# Altium project PC104-M7.PrjPcb (part 2 of 2)

## Sheet Power.SchDoc
size A4; SheetNumber: 10; SheetTotal: 12
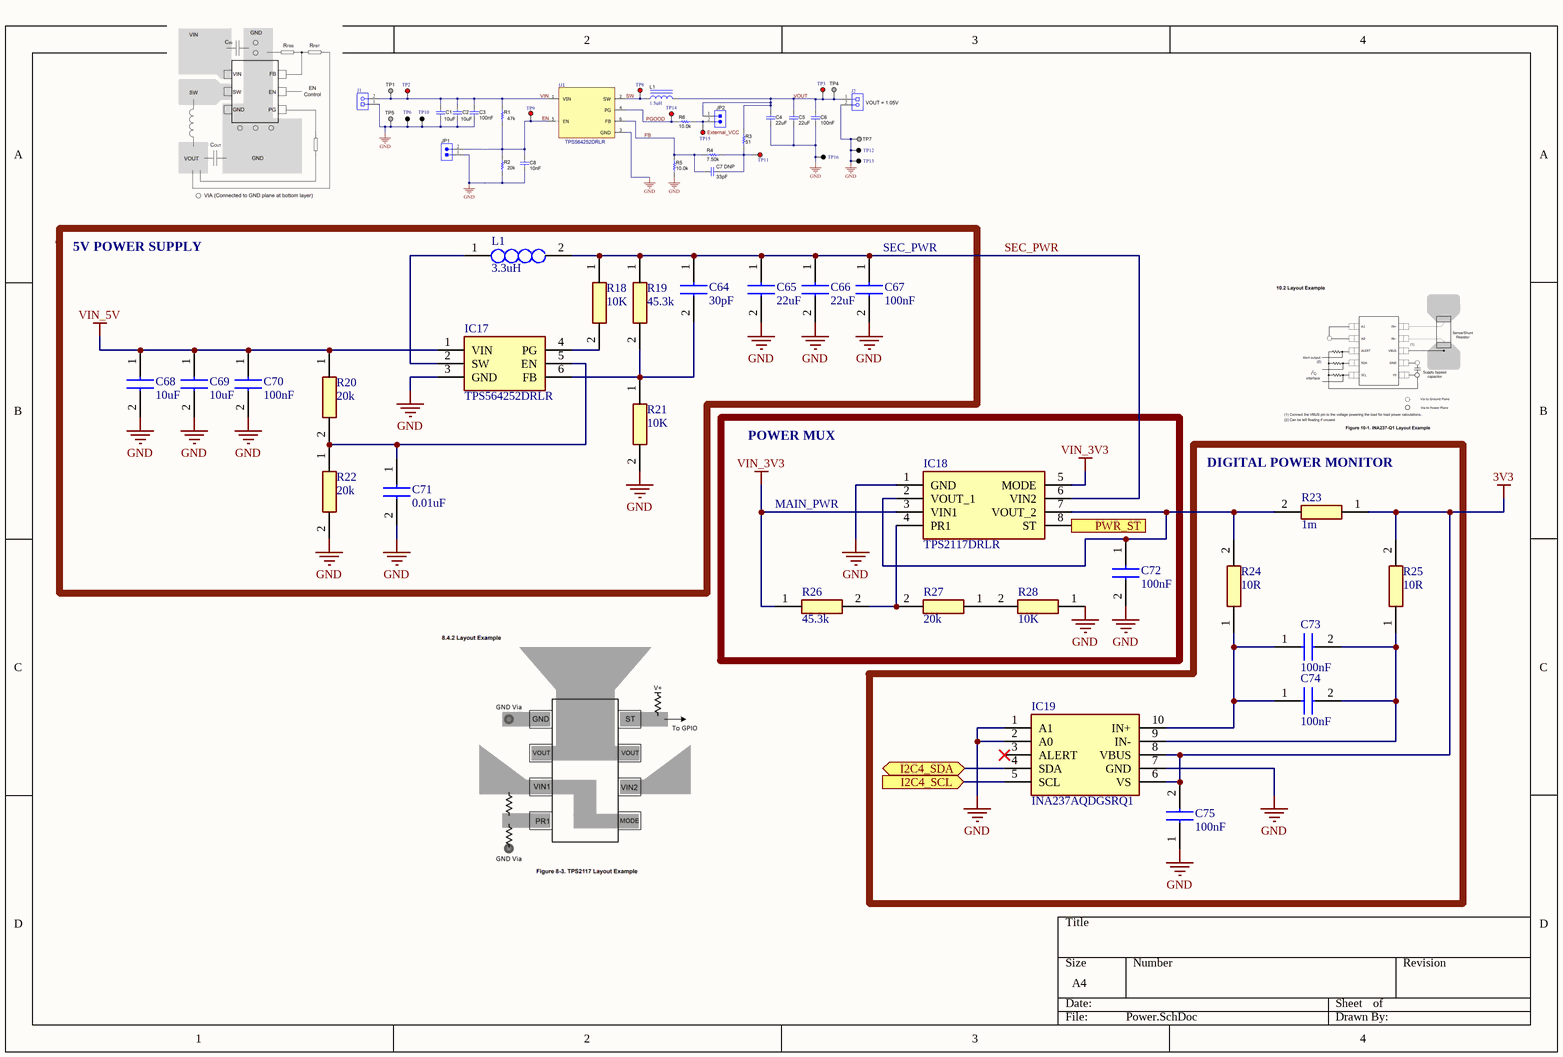
[diagram p9: Power.SchDoc]

### Parts
C64  30pF  [C0603]
C65  22uF  [CAPC1608X90N]
C66  22uF  [CAPC1608X90N]
C67  100nF  [CAPC1608X95N]
C68  10uF  [CAPC1608X90N]
C69  10uF  [CAPC1608X90N]
C70  100nF  [CAPC1608X95N]
C71  0.01uF  [C0603]
C72  100nF  [CAPC1608X95N]
C73  100nF  [CAPC1608X95N]
C74  100nF  [CAPC1608X95N]
C75  100nF  [CAPC1608X95N]
IC17  TPS564252DRLR  [SOTFL50P160X60-6N]
IC18  TPS2117DRLR  [SOTFL50P160X60-8N]
IC19  INA237AQDGSRQ1  [SOP50P490X110-10N]
L1  3.3uH  [INDPM5653X430N]
R18  10K  [RESC1508X50N]
R19  45.3k  [RESC1608X55N]
R20  20k  [RESC1608X55N]
R21  10K  [RESC1508X50N]
R22  20k  [RESC1608X55N]
R23  1m  [RESC2012X80N]
R24  10R  [RESC1608X55N]
R25  10R  [RESC1608X55N]
R26  45.3k  [RESC1608X55N]
R27  20k  [RESC1608X55N]
R28  10K  [RESC1508X50N]

### Blocks framed on the sheet
5V POWER SUPPLY: C64-C71 IC17 L1 R18-R22
POWER MUX: C72 IC18 R26-R28
DIGITAL POWER MONITOR: C73-C75 IC19 R23-R25

### Ports
I2C4_SCL (in), I2C4_SDA (bidir), PWR_ST (out)

### Nets
3V3: C75.2 IC19.6(VS) IC19.8(VBUS) R23.1 R25.2  [project net PDR_ON]
GND: C65.2 C66.2 C67.2 C68.2 C69.2 C70.2 C71.2 C72.2 C75.1 IC17.3(GND) IC18.1(GND) IC19.1(A1) IC19.2(A0) IC19.7(GND) R21.2 R22.2 R28.1  [project net VSS]
VIN_3V3: IC18.3(VIN1) IC18.5(MODE) R26.1
VIN_5V: C68.1 C69.1 C70.1 IC17.1(VIN) R20.1
I2C4_SCL: IC19.5(SCL) ; port I2C4_SCL
I2C4_SDA: IC19.4(SDA) ; port I2C4_SDA
PWR_ST: IC18.8(ST) ; port PWR_ST
SEC_PWR: C64.1 C65.1 C66.1 C67.1 IC18.6(VIN2) L1.2 R18.1 R19.1
NetC64_2: C64.2 IC17.6(FB) R19.2 R21.1
NetC71_1: C71.1 IC17.5(EN) R20.2 R22.1
NetC72_1: C72.1 IC18.2(VOUT_1) IC18.7(VOUT_2) R23.2 R24.2
NetC73_1: C73.1 C74.1 IC19.10(IN+) R24.1
NetC73_2: C73.2 C74.2 IC19.9(IN-) R25.1
NetIC17_2: IC17.2(SW) L1.1
NetIC17_4: IC17.4(PG) R18.2
NetIC18_4: IC18.4(PR1) R26.2 R27.2
NetR27_1: R27.1 R28.2

Not connected (* = marked no-connect by the designer): IC19 3(ALERT)*

### Notes on the sheet
- (near C67) SEC_PWR
- MAIN_PWR

### Library data of the parts
C64 = C0603C300F5HACAUTO: 30 pF ±1% 50V Ceramic Capacitor X8R 0603 (1608 Metric); Manufacturer_Name: KEMET; Datasheet Link: https://content.kemet.com/datasheets/KEM_C1007_X8R_ULTRA_150C_SMD.pdf; Height: 0.87mm; Manufacturer_Part_Number: C0603C300F5HACAUTO; Mouser Part Number: 80-C0603C300F5HAUTO; Mouser Price/Stock: https://www.mouser.com/Search/Refine.aspx?Keyword=80-C0603C300F5HAUTO
C65 C66 = GRT188R61A226ME13D: 22 µF ±20% 10V Ceramic Capacitor X5R 0603 (1608 Metric); Manufacturer_Name: Murata Electronics; Datasheet Link: https://psearch.en.murata.com/capacitor/product/GRT188R61A226ME13%23.html; Height: 0.9mm; Manufacturer_Part_Number: GRT188R61A226ME13D; Mouser Part Number: 81-GRT188R61A226ME13; Mouser Price/Stock: https://www.mouser.co.uk/ProductDetail/Murata-Electronics/GRT188R61A226ME13D?qs=rrS6PyfT74d5NiMXLiYh8Q%3D%3D; Arrow Part Number: GRT188R61A226ME13D; Arrow Price/Stock: https://www.arrow.com/en/products/grt188r61a226me13d/murata-manufacturing?region=nac
C67 C70 C72-C75 = C0603C104M4RAC7867: 0.1 µF ±20% 16V Ceramic Capacitor X7R 0603 (1608 Metric); Manufacturer_Name: KEMET; Datasheet Link: https://www.arrow.com/en/products/c0603c104m4rac7867/kemet-corporation?region=nac; Height: 0.95mm; Manufacturer_Part_Number: C0603C104M4RAC7867; Mouser Part Number: N/A; Mouser Price/Stock: https://www.mouser.co.uk/ProductDetail/KEMET/C0603C104M4RAC7867?qs=nAEW9fCjKd%252BI998RVtZhZQ%3D%3D; Arrow Part Number: C0603C104M4RAC7867; Arrow Price/Stock: https://www.arrow.com/en/products/c0603c104m4rac7867/kemet-corporation?region=europe
C68 C69 = GRM188D71A106KA73D: CAP CER 10UF 10V X7T 0603; Manufacturer_Name: Murata Electronics; Datasheet Link: https://psearch.en.murata.com/capacitor/product/GRM188D71A106KA73%23.html; Height: 0.9mm; Manufacturer_Part_Number: GRM188D71A106KA73D; Mouser Part Number: 81-GRM188D71A106KA3D; Mouser Price/Stock: https://www.mouser.co.uk/ProductDetail/Murata-Electronics/GRM188D71A106KA73D?qs=FvQ4nYu%252B2He2GIhYKxXmMQ%3D%3D; Arrow Part Number: GRM188D71A106KA73D; Arrow Price/Stock: https://www.arrow.com/en/products/grm188d71a106ka73d/murata-manufacturing?region=nac
C71 = C0603C103KMRECAUTO: 10000 pF ±10% 63V Ceramic Capacitor X7R 0603 (1608 Metric); Manufacturer_Name: KEMET; Datasheet Link: https://content.kemet.com/datasheets/KEM_C1090_X7R_ESD.pdf; Height: 0.87mm; Manufacturer_Part_Number: C0603C103KMRECAUTO; Mouser Part Number: 80-C0603C103KMREAUTO; Mouser Price/Stock: https://www.mouser.co.uk/ProductDetail/KEMET/C0603C103KMRECAUTO?qs=u4fy%2FsgLU9P0r6p3bzZgfw%3D%3D; Arrow Part Number: C0603C103KMRECAUTO; Arrow Price/Stock: https://www.arrow.com/en/products/c0603c103kmrecauto/kemet-corporation?region=nac
IC17 = TPS564257DRLR: TPS564252DRLR / Buck Switching Regulator IC Positive Adjustable 0.6V 1 Output 4A SOT-563, SOT-666; Manufacturer_Name: Texas Instruments; Datasheet Link: https://www.ti.com/lit/ds/symlink/tps564257.pdf?HQS=dis-mous-null-mousermode-dsf-pf-null-wwe&ts=1695023870951&ref_url=https%253A%252F%252Fwww.mouser.de%252F; Height: 0.6mm; Manufacturer_Part_Number: TPS564257DRLR; Mouser Part Number: 595-TPS564257DRLR; Mouser Price/Stock: https://www.mouser.co.uk/ProductDetail/Texas-Instruments/TPS564257DRLR?qs=ulEaXIWI0c8amaZvnJWTQQ%3D%3D
IC18 = TPS2116DRLR: Power Switch/Driver 1:1 N-Channel 4A SOT-583; Manufacturer_Name: Texas Instruments; Datasheet Link: https://www.ti.com/lit/gpn/tps2116; Height: 0.6mm; Manufacturer_Part_Number: TPS2116DRLR; Mouser Part Number: 595-TPS2116DRLR; Mouser Price/Stock: https://www.mouser.co.uk/ProductDetail/Texas-Instruments/TPS2116DRLR?qs=aP1CjGhiNiGo3XAyXcVPaQ%3D%3D; Arrow Part Number: TPS2116DRLR; Arrow Price/Stock: https://www.arrow.com/en/products/tps2116drlr/texas-instruments?region=nac
IC19 = INA237AQDGSRQ1: Power Supply Controller 10-VSSOP; Manufacturer_Name: Texas Instruments; Datasheet Link: https://www.ti.com/lit/ds/symlink/ina237-q1.pdf?ts=1625619121802; Height: 1.1mm; Manufacturer_Part_Number: INA237AQDGSRQ1; Mouser Part Number: 595-INA237AQDGSRQ1; Mouser Price/Stock: https://www.mouser.co.uk/ProductDetail/Texas-Instruments/INA237AQDGSRQ1?qs=QNEnbhJQKvZMdvZTHxOefQ%3D%3D; Arrow Part Number: INA237AQDGSRQ1; Arrow Price/Stock: https://www.arrow.com/en/products/ina237aqdgsrq1/texas-instruments?region=nac
L1 = 744316330: 3.3 µH Shielded Wirewound Inductor 5.75 A 18.5mOhm 2-SMD; Manufacturer_Name: Wurth Elektronik; Datasheet Link: https://componentsearchengine.com/Datasheets/1/744316330.pdf; Height: 4.3mm; Manufacturer_Part_Number: 744316330; Mouser Part Number: 710-744316330; Mouser Price/Stock: https://www.mouser.co.uk/ProductDetail/Wurth-Elektronik/744316330?qs=%252B7BPNfeNhvX5azP5TkUELg%3D%3D
R18 R21 R28 = RNCP0603FTD10K0: 10 kOhms ±1% 0.125W, 1/8W Chip Resistor 0603 (1608 Metric) Anti-Sulfur Thin Film; Manufacturer_Name: Stackpole Electronics; Datasheet Link: https://cs.seielect.com/catalog/SEI-RNCP.pdf; Height: 0.5mm; Manufacturer_Part_Number: RNCP0603FTD10K0; Mouser Part Number: 708-RNCP0603FTD10K0; Mouser Price/Stock: https://www.mouser.co.uk/ProductDetail/SEI-Stackpole/RNCP0603FTD10K0?qs=FESYatJ8odL1jmHQSpKOPg%3D%3D; Arrow Part Number: RNCP0603FTD10K0; Arrow Price/Stock: https://www.arrow.com/en/products/rncp0603ftd10k0/stackpole-electronics?region=nac
R19 R26 = RMCF0603FT45K3: 45.3 kOhms ±1% 0.1W, 1/10W Chip Resistor 0603 (1608 Metric) Automotive AEC-Q200 Thick Film; Manufacturer_Name: Stackpole Electronics; Datasheet Link: https://www.seielect.com/Catalog/SEI-RMCF_RMCP.pdf; Height: 0.55mm; Manufacturer_Part_Number: RMCF0603FT45K3; Arrow Part Number: RMCF0603FT45K3; Arrow Price/Stock: https://www.arrow.com/en/products/rmcf0603ft45k3/stackpole-electronics
R20 R22 R27 = ERJ-3EKF2002V: 20 kOhms ±1% 0.1W, 1/10W Chip Resistor 0603 (1608 Metric) Automotive AEC-Q200 Thick Film; Manufacturer_Name: Panasonic; Datasheet Link: http://industrial.panasonic.com/cdbs/www-data/pdf/RDA0000/AOA0000C86.pdf; Height: 0.55mm; Manufacturer_Part_Number: ERJ-3EKF2002V; Mouser Part Number: 667-ERJ-3EKF2002V; Mouser Price/Stock: https://www.mouser.co.uk/ProductDetail/Panasonic/ERJ-3EKF2002V?qs=66DK8nO8gJB3y0uxig0mNg%3D%3D; Arrow Part Number: ERJ-3EKF2002V; Arrow Price/Stock: https://www.arrow.com/en/products/erj-3ekf2002v/panasonic?region=europe
R23 = CRF0805-FZ-R001ELF: 1 mOhms ±1% 0.5W, 1/2W Chip Resistor 0805 (2012 Metric) Automotive AEC-Q200, Current Sense, Moisture Resistant Metal Element; Manufacturer_Name: Bourns; Datasheet Link: https://www.bourns.com/docs/product-datasheets/CRF.pdf; Height: 0.8mm; Manufacturer_Part_Number: CRF0805-FZ-R001ELF; Mouser Part Number: 652-CRF0805FZR001ELF; Mouser Price/Stock: https://www.mouser.co.uk/ProductDetail/Bourns/CRF0805-FZ-R001ELF?qs=t7xnP681wgV0AIQaUselMQ%3D%3D; Arrow Part Number: CRF0805-FZ-R001ELF; Arrow Price/Stock: https://www.arrow.com/en/products/crf0805-fz-r001elf/bourns?region=nac
R24 R25 = ERJ-3EKF10R0V: 10 Ohms ±1% 0.1W, 1/10W Chip Resistor 0603 (1608 Metric) Automotive AEC-Q200 Thick Film; Manufacturer_Name: Panasonic; Datasheet Link: http://industrial.panasonic.com/cdbs/www-data/pdf/RDA0000/AOA0000C86.pdf; Height: 0.55mm; Manufacturer_Part_Number: ERJ-3EKF10R0V; Mouser Part Number: 667-ERJ-3EKF10R0V; Mouser Price/Stock: https://www.mouser.co.uk/ProductDetail/Panasonic/ERJ-3EKF10R0V?qs=Y94Hbc6uvEMT73hhx3Gvwg%3D%3D; Arrow Part Number: ERJ-3EKF10R0V; Arrow Price/Stock: https://www.arrow.com/en/products/erj-3ekf10r0v/panasonic?region=nac

## Sheet AOCS.SchDoc
size A4; SheetNumber: 4; SheetTotal: 12
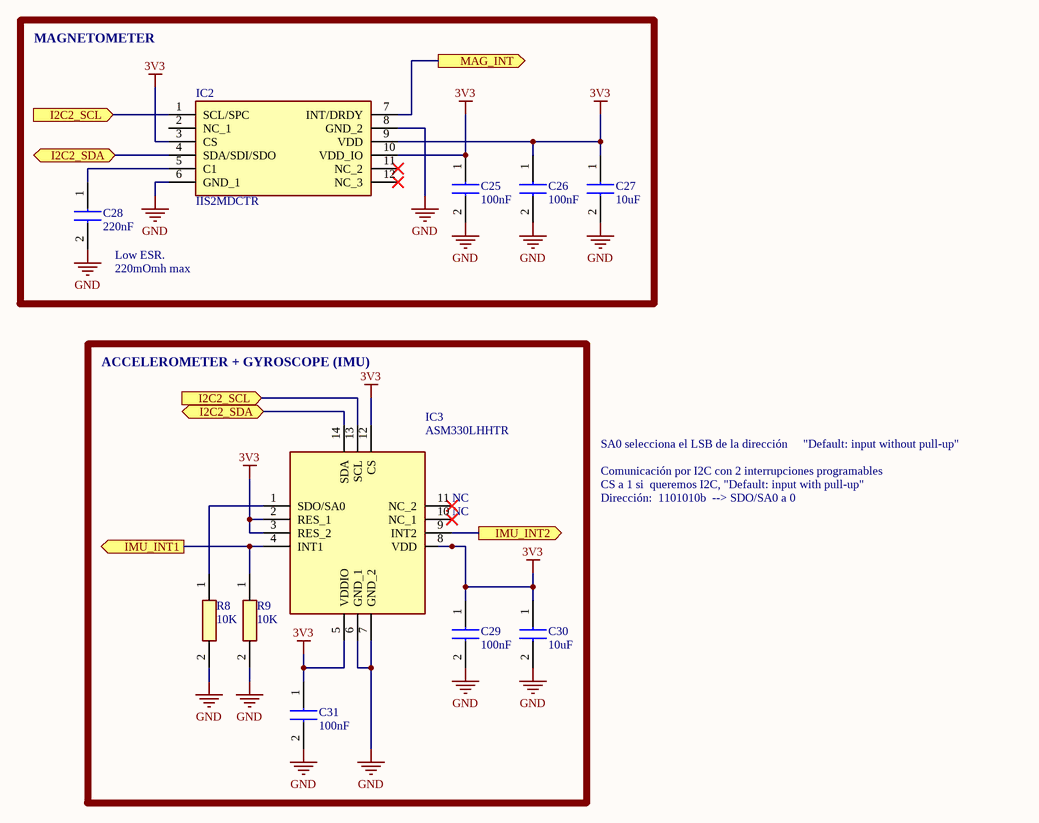
[diagram p10: AOCS.SchDoc]

### Parts
C25  100nF  [CAPC1608X95N]
C26  100nF  [CAPC1608X95N]
C27  10uF  [CAPC1608X90N]
C28  220nF  [C0603]
C29  100nF  [CAPC1608X95N]
C30  10uF  [CAPC1608X90N]
C31  100nF  [CAPC1608X95N]
IC2  IIS2MDCTR  [IIS2MDCTR]
IC3  ASM330LHHTR  [LGA-14(2.5X3X0.86)]
R8  10K  [RESC1508X50N]
R9  10K  [RESC1508X50N]

### Blocks framed on the sheet
MAGNETOMETER: C25-C28 IC2
ACCELEROMETER + GYROSCOPE (IMU): C29-C31 IC3 R8 R9

### Ports
I2C2_SCL (in), I2C2_SDA (bidir), IMU_INT1 (out), IMU_INT2 (out), MAG_INT (out)

### Nets
3V3: C25.1 C26.1 C27.1 C29.1 C30.1 C31.1 IC2.3(CS) IC2.9(VDD) IC2.10(VDD_IO) IC3.2(RES_1) IC3.3(RES_2) IC3.5(VDDIO) IC3.8(VDD) IC3.12(CS)  [project net PDR_ON]
GND: C25.2 C26.2 C27.2 C28.2 C29.2 C30.2 C31.2 IC2.6(GND_1) IC2.8(GND_2) IC3.6(GND_1) IC3.7(GND_2) R8.2 R9.2  [project net VSS]
I2C2_SCL: IC2.1(SCL/SPC) IC3.13(SCL) ; port I2C2_SCL
I2C2_SDA: IC2.4(SDA/SDI/SDO) IC3.14(SDA) ; port I2C2_SDA
IMU_INT1: IC3.4(INT1) R9.1 ; port IMU_INT1
IMU_INT2: IC3.9(INT2) ; port IMU_INT2
MAG_INT: IC2.7(INT/DRDY) ; port MAG_INT
NetC28_1: C28.1 IC2.5(C1)
NetIC3_1: IC3.1(SDO/SA0) R8.1

Not connected (* = marked no-connect by the designer): IC2 2(NC_1) 11(NC_2)* 12(NC_3)*; IC3 10(NC_1)* 11(NC_2)*

### Notes on the sheet
- (near C28) Low ESR.
- (near C28) 220mOmh max
- (near IC3) NC
- Comunicación por I2C con 2 interrupciones programables
- CS a 1 si  queremos I2C, "Default: input with pull-up"
- SA0 selecciona el LSB de la dirección
- Dirección:  1101010b  --> SDO/SA0 a 0
- "Default: input without pull-up"

### Library data of the parts
C25 C26 C29 C31 = C0603C104M4RAC7867: as C67 on sheet Power; Datasheet Link: https://www.arrow.com/en/products/c0603c104m4rac7867/kemet-corporation?region=nac; Height: 0.95mm; Manufacturer_Part_Number: C0603C104M4RAC7867; Mouser Part Number: N/A; Mouser Price/Stock: https://www.mouser.co.uk/ProductDetail/KEMET/C0603C104M4RAC7867?qs=nAEW9fCjKd%252BI998RVtZhZQ%3D%3D; Arrow Part Number: C0603C104M4RAC7867; Arrow Price/Stock: https://www.arrow.com/en/products/c0603c104m4rac7867/kemet-corporation?region=europe
C27 C30 = GRM188D71A106KA73D: as C68 on sheet Power; Datasheet Link: https://psearch.en.murata.com/capacitor/product/GRM188D71A106KA73%23.html; Height: 0.9mm; Manufacturer_Part_Number: GRM188D71A106KA73D; Mouser Part Number: 81-GRM188D71A106KA3D; Mouser Price/Stock: https://www.mouser.co.uk/ProductDetail/Murata-Electronics/GRM188D71A106KA73D?qs=FvQ4nYu%252B2He2GIhYKxXmMQ%3D%3D; Arrow Part Number: GRM188D71A106KA73D; Arrow Price/Stock: https://www.arrow.com/en/products/grm188d71a106ka73d/murata-manufacturing?region=nac
C28 = C0603C224K4RECAUTO: 0.22 µF ±10% 16V Ceramic Capacitor X7R 0603 (1608 Metric); Manufacturer_Name: KEMET; Datasheet Link: https://content.kemet.com/datasheets/KEM_C1090_X7R_ESD.pdf; Height: 0.87mm; Manufacturer_Part_Number: C0603C224K4RECAUTO; Mouser Part Number: 80-C0603C224K4RECAUT; Mouser Price/Stock: https://www.mouser.co.uk/ProductDetail/KEMET/C0603C224K4RECAUTO?qs=MLItCLRbWszB36u3S8vAZQ%3D%3D; Arrow Part Number: C0603C224K4RECAUTO; Arrow Price/Stock: https://www.arrow.com/en/products/c0603c224k4recauto/kemet-corporation
IC2 = IIS2MDCTR: Magnetoresistive Sensor X, Y, Z Axis 12-LGA (2x2); Manufacturer_Name: STMicroelectronics; Datasheet Link: https://www.st.com/resource/en/datasheet/iis2mdc.pdf; Height: 0.7mm; Manufacturer_Part_Number: IIS2MDCTR; Mouser Part Number: 511-IIS2MDCTR; Mouser Price/Stock: https://www.mouser.co.uk/ProductDetail/STMicroelectronics/IIS2MDCTR?qs=1mbolxNpo8ems1K%2FRdQzXg%3D%3D; Arrow Part Number: IIS2MDCTR; Arrow Price/Stock: https://www.arrow.com/en/products/iis2mdctr/stmicroelectronics?region=nac
IC3 = ASM330LHHTR: Accelerometer, Gyroscope, Temperature, 6 Axis Sensor I²C, SPI Output; Manufacturer_Name: STMicroelectronics; Datasheet Link: https://www.st.com/resource/en/datasheet/asm330lhh.pdf; Manufacturer_Part_Number: ASM330LHHTR; Mouser Part Number: 511-ASM330LHHTR; Mouser Price/Stock: https://www.mouser.co.uk/ProductDetail/STMicroelectronics/ASM330LHHTR?qs=lc2O%252BfHJPVYgP8P9MzExKQ%3D%3D; Arrow Part Number: ASM330LHHTR; Arrow Price/Stock: https://www.arrow.com/en/products/asm330lhhtr/stmicroelectronics?region=nac
R8 R9 = RNCP0603FTD10K0: as R18 on sheet Power; Datasheet Link: https://cs.seielect.com/catalog/SEI-RNCP.pdf; Height: 0.5mm; Manufacturer_Part_Number: RNCP0603FTD10K0; Mouser Part Number: 708-RNCP0603FTD10K0; Mouser Price/Stock: https://www.mouser.co.uk/ProductDetail/SEI-Stackpole/RNCP0603FTD10K0?qs=FESYatJ8odL1jmHQSpKOPg%3D%3D; Arrow Part Number: RNCP0603FTD10K0; Arrow Price/Stock: https://www.arrow.com/en/products/rncp0603ftd10k0/stackpole-electronics?region=nac

## Nets that join several sheets
PDR_ON: Connectors (J?#2.2 J?#2.4), MCU (45 pins), CAN (6 pins), RS485 (8 pins), MemoryStorage (15 pins), TempSensors (22 pins), ExternalConnectors (J3.2), Power (5 pins), AOCS (14 pins)
VIN_3V3: BoardConnectors (H2.27 H2.28), Power (IC18.3 IC18.5 R26.1)
VIN_5V: BoardConnectors (H2.25 H2.26), Power (5 pins)
VSS: Connectors (J?#1.7 J?#2.6 J?#2.7), MCU (36 pins), CAN (6 pins), RS485 (12 pins), MemoryStorage (19 pins), TempSensors (32 pins), ExternalConnectors (10 pins), BoardConnectors (6 pins), Power (17 pins), AOCS (13 pins)
BRD_GPIO1: MCU (IC1.93), BoardConnectors (H1.13)
BRD_GPIO2: MCU (IC1.92), BoardConnectors (H1.16)
BRD_GPIO3: MCU (IC1.91), BoardConnectors (H1.15)
BRD_GPIO4: MCU (IC1.90), BoardConnectors (H2.18)
BRD_GPIO5: MCU (IC1.89), BoardConnectors (H2.17)
BRD_GPIO6: MCU (IC1.88), BoardConnectors (H1.18)
BRD_GPIO7: MCU (IC1.87), BoardConnectors (H1.17)
EXT_GPIO1: MCU (IC1.26), ExternalConnectors (J5.4)
EXT_GPIO2: MCU (IC1.27), ExternalConnectors (J5.3)
EXT_GPIO3: MCU (IC1.28), ExternalConnectors (J5.2)
EXT_GPIO4: MCU (IC1.29), ExternalConnectors (J5.1)
FDCAN1_FAULT: MCU (IC1.97), CAN (IC4.5)
FDCAN1_N: CAN (IC4.6 R10.2), BoardConnectors (H1.1)
FDCAN1_P: CAN (IC4.7 R10.1), BoardConnectors (H1.3)
FDCAN1_RX: MCU (IC1.103), CAN (IC4.4)
FDCAN1_S: MCU (IC1.98), CAN (IC4.8)
FDCAN1_TX: MCU (IC1.104), CAN (IC4.1)
FDCAN2_FAULT: MCU (IC1.129), CAN (IC5.5)
FDCAN2_N: CAN (IC5.6 R11.2), BoardConnectors (H2.1)
FDCAN2_P: CAN (IC5.7 R11.1), BoardConnectors (H2.3)
FDCAN2_RX: MCU (IC1.135), CAN (IC5.4)
FDCAN2_S: MCU (IC1.128), CAN (IC5.8)
FDCAN2_TX: MCU (IC1.136), CAN (IC5.1)
FRAM1_HOLD: MCU (IC1.57), MemoryStorage (IC12.7)
FRAM2_HOLD: MCU (IC1.47), MemoryStorage (IC13.7)
FRAM3_HOLD: MCU (IC1.45), MemoryStorage (IC14.7)
I2C1_SCL: MCU (IC1.139 R3.2), ExternalConnectors (J8.2), BoardConnectors (H1.43)
I2C1_SDA: MCU (IC1.140 R2.2), ExternalConnectors (J8.3), BoardConnectors (H1.41)
I2C2_SCL: MCU (IC1.11 R5.2), AOCS (IC2.1 IC3.13)
I2C2_SDA: MCU (IC1.10 R4.2), AOCS (IC2.4 IC3.14)
I2C4_SCL: MCU (IC1.54 R7.2), TempSensors (5 pins), Power (IC19.5)
I2C4_SDA: MCU (IC1.55 R6.2), TempSensors (5 pins), Power (IC19.4)
IMU_INT1: MCU (IC1.53), AOCS (IC3.4 R9.1)
IMU_INT2: MCU (IC1.50), AOCS (IC3.9)
JRST: MCU (IC1.134), ExternalConnectors (J4.10)
JTCK-SWCLK: MCU (IC1.109), ExternalConnectors (J4.4)
JTDI: MCU (IC1.110), ExternalConnectors (J4.8)
JTDO-SWO: MCU (IC1.133), ExternalConnectors (J4.6)
JTMS-SWDIO: MCU (IC1.105), ExternalConnectors (J4.2)
MAG_INT: MCU (IC1.49), AOCS (IC2.7)
MCP_PWR: MCU (IC1.12), TempSensors (S1.3)
PWR_ST: MCU (IC1.80), Power (IC18.8)
RCC_MCO_1: MCU (IC1.100), BoardConnectors (H1.11)
RS485_1_N: RS485 (D1.2 IC15.6 R12.2), ExternalConnectors (J6.2)
RS485_1_P: RS485 (D2.2 IC15.7 R12.1), ExternalConnectors (J6.3)
RS485_2_DE: MCU (IC1.73), RS485 (IC16.3 R17.1)
RS485_2_N: RS485 (D3.2 IC16.6 R15.2), ExternalConnectors (J7.2)
RS485_2_P: RS485 (D4.2 IC16.7 R15.1), ExternalConnectors (J7.3)
RS485_2_RE: MCU (IC1.68), RS485 (IC16.2 R16.1)
RTC_OUT_ALARM: MCU (IC1.7), BoardConnectors (H2.48)
RTC_OUT_CALIB: MCU (IC1.48), BoardConnectors (H2.49)
SD1_CD1: MCU (IC1.117), MemoryStorage (J1.CD1)
SD1_CD2: MCU (IC1.116), MemoryStorage (J1.CD2)
SD2_CD1: MCU (IC1.115), MemoryStorage (J2.CD1)
SD2_CD2: MCU (IC1.114), MemoryStorage (J2.CD2)
SPI1_CS1: MCU (IC1.56), MemoryStorage (IC12.1)
SPI1_CS2: MCU (IC1.46), MemoryStorage (IC13.1)
SPI1_CS3: MCU (IC1.44), MemoryStorage (IC14.1)
SPI1_MISO: MCU (IC1.42), MemoryStorage (IC12.2 IC13.2 IC14.2)
SPI1_MOSI: MCU (IC1.43), MemoryStorage (IC12.5 IC13.5 IC14.5)
SPI1_SCK: MCU (IC1.41), MemoryStorage (IC12.6 IC13.6 IC14.6)
SPI2_CS1: MCU (IC1.78), BoardConnectors (H2.13)
SPI2_CS2: MCU (IC1.77), BoardConnectors (H2.15)
SPI2_MISO: MCU (IC1.75), BoardConnectors (H2.9)
SPI2_MOSI: MCU (IC1.76), BoardConnectors (H2.10)
SPI2_SCK: MCU (IC1.74), BoardConnectors (H2.11)
SPI3_CS1: MCU (IC1.118), MemoryStorage (J1.P2)
SPI3_CS2: MCU (IC1.119), MemoryStorage (J2.P2)
SPI3_MISO: MCU (IC1.112), MemoryStorage (J1.P7 J2.P7)
SPI3_MOSI: MCU (IC1.113), MemoryStorage (J1.P3 J2.P3)
SPI3_SCK: MCU (IC1.111), MemoryStorage (J1.P5 J2.P5)
SPI5_CS1: MCU (IC1.15), ExternalConnectors (J11.1)
SPI5_CS2: MCU (IC1.18), ExternalConnectors (J11.2)
SPI5_MISO: MCU (IC1.20), ExternalConnectors (J11.4)
SPI5_MOSI: MCU (IC1.21), ExternalConnectors (J11.5)
SPI5_SCK: MCU (IC1.19), ExternalConnectors (J11.3)
TIM1_CH1: MCU (IC1.60), BoardConnectors (H2.47)
TIM4_CH1: MCU (IC1.81), BoardConnectors (H1.20)
TIM4_CH2: MCU (IC1.82), BoardConnectors (H1.19)
TIM4_CH3: MCU (IC1.85), BoardConnectors (H2.19)
TIM4_CH4: MCU (IC1.86), BoardConnectors (H2.20)
TIM8_CH1: MCU (IC1.96), BoardConnectors (H1.14)
UART1_RX: MCU (IC1.102), BoardConnectors (H1.5 H1.6)
UART1_TX: MCU (IC1.101), BoardConnectors (H1.7 H1.8)
UART3_RX: MCU (IC1.70), RS485 (IC16.1)
UART3_TX: MCU (IC1.69), RS485 (IC16.4)
UART4_RX: MCU (IC1.35), RS485 (IC15.1)
UART4_TX: MCU (IC1.34), RS485 (IC15.4)
UART7_RX: MCU (IC1.58), ExternalConnectors (J9.3)
UART7_TX: MCU (IC1.59), ExternalConnectors (J9.2)
UART8_RX: MCU (IC1.141), ExternalConnectors (J10.3)
UART8_TX: MCU (IC1.142), ExternalConnectors (J10.2)